# Altium schematic sheet Port.SchDoc
size A4; SheetNumber: 5; SheetTotal: 8
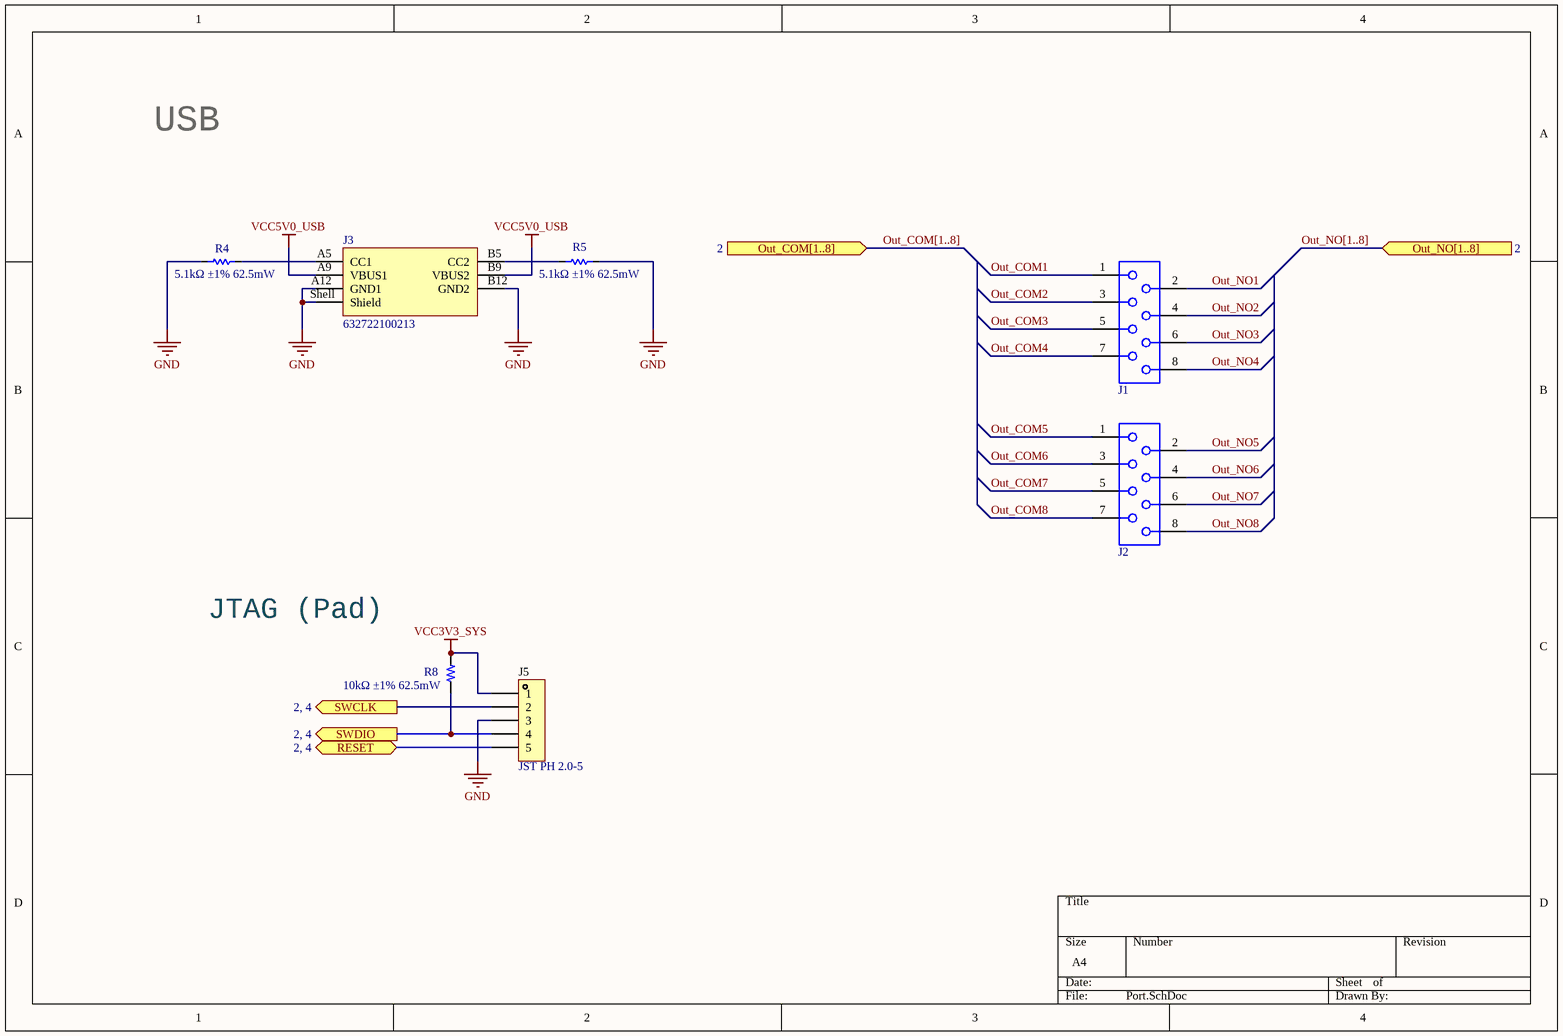
[diagram p0: Port.SchDoc]

## Parts
J1  690367290876  [690367290876]  (value not drawn)
J2  690367290876  [690367290876]  (value not drawn)
J3  632722100213  [632722100213]
J5  JST PH 2.0-5  [CONN-TH_B5B-PH-K-S-LF-SN]
R4  5.1kΩ ±1% 62.5mW  [R0402]
R5  5.1kΩ ±1% 62.5mW  [R0402]
R8  10kΩ ±1% 62.5mW  [R0402]

## Ports
Out_COM[1..8] (in, see 2), Out_NO[1..8] (in, see 2), RESET (bidir, see 2, 4), SWCLK (out, see 2, 4), SWDIO (out, see 2, 4)

## Nets
GND: J3.A12(GND1) J3.B12(GND2) J3.Shell(Shield) J5.3 R4.1 R5.2
VCC3V3_SYS: J5.1 R8.2
VCC5V0_USB: J3.A9(VBUS1) J3.B9(VBUS2)
Out_COM1: J1.1
Out_COM2: J1.3
Out_COM3: J1.5
Out_COM4: J1.7
Out_COM5: J2.1
Out_COM6: J2.3
Out_COM7: J2.5
Out_COM8: J2.7
Out_NO1: J1.2
Out_NO2: J1.4
Out_NO3: J1.6
Out_NO4: J1.8
Out_NO5: J2.2
Out_NO6: J2.4
Out_NO7: J2.6
Out_NO8: J2.8
RESET: J5.5 ; port RESET
SWCLK: J5.2 ; port SWCLK
SWDIO: J5.4 R8.1 ; port SWDIO
NetJ3_A5: J3.A5(CC1) R4.2
NetJ3_B5: J3.B5(CC2) R5.1

## Buses and harness runs
bus Out_COM[1..8] = port Out_COM[1..8]
bus Out_NO[1..8] = port Out_NO[1..8]

## Notes on the sheet
- USB
- JTAG (Pad)

## Library data of the parts
J1 J2 = 690367290876: WR-MM Mini Module Connector, Female, SMT, with Latch & Polarization, Straight, pitch 2.54mm, 8p; Manufacturer: Wurth Elektronik; Contact Resistance: 10mΩ; Insulation Resistance: 1000MΩ; Rated Current: 1.5A; Working Voltage: 250VAC; Withstanding Voltage: 500VAC; ComponentLink1Description: Website Link; ComponentLink1URL: https://www.we-online.com/redexpert/article/690367290876?ad; ComponentLink2Description: Datasheet Link; ComponentLink2URL: https://www.we-online.com/redexpert/spec/690367290876?ad; Manufacturer Part Number: 690367290876; Category: Board-to-Board Connectors; Match Code: WR-MM; Mount: Surface Mount; Operating Temperature Max: 105°C; Operating Temperature Min: -40°C; Packaging: Tape and Reel; Length: 14.76mm; Gender: Female; Number of Pins: 8; Orientation: Straight; Pitch: 2.54mm
J3 = 632722100213: WR-COM USB Power Delivery Type C Receptacle Horizontal SMT; Manufacturer: Wurth Elektronik; Match Code: WR-USB; Number of Ports: 1; Rated Current: 5; Working Voltage: 48V (DC); Manufacturer Part Number: 632722100213; Category: Input/Output Connectors; ComponentLink1Description: Website Link; ComponentLink1URL: https://www.we-online.com/redexpert/article/632722100213?ad; ComponentLink2Description: Datasheet Link; ComponentLink2URL: https://www.we-online.com/redexpert/spec/632722100213?ad; Mount: Surface Mount; Min Operating Temperature: -40°C; Max Operating Temperature: 85°C; Packaging: Tape and Reel; Application: USB Power Delivery; Gender: Receptacle; Number of Pins: 6; Orientation: Horizontal
J5 = PH2.0-5P: B5B-PH-K-S; Manufacturer: BOOMELE(博穆精密); Name: GH1.25-5PLTPZ; Add into BOM: yes; Symbol: GH1.25-5PLTPZ; Device: GH1.25-5PLTPZ; LCSC Part Name: GH1.25-5P立贴编带加盖; Supplier Part: C2829263; Manufacturer Part: GH1.25-5PLTPZ; Supplier Footprint: -; JLCPCB Part Class: Extended Part; Datasheet: https://atta.szlcsc.com/upload/public/pdf/source/20211125/08A09A4909F58AF780B71FE423A00F7E.pdf; Supplier: LCSC; Convert to PCB: yes
R4 R5 = Res: Resistor; Published: 8-Jun-2000; LatestRevisionDate: 17-Jul-2002; LatestRevisionNote: Re-released for DXP Platform.; PackageReference: AXIAL-0.3; Publisher: Altium Limited; PackageDescription: Axial Device, Thru-Hole; 2 Leads; 0.3 in Pin Spacing
R8 = R-0603: 0402WGF1002TCE